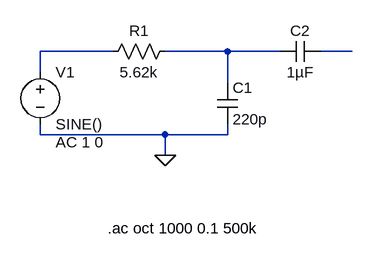
[diagram p0: schematic ADC_LineIn_filt.asc]
ADC_LineIn_filt.asc, the LTspice schematic file:
Version 4
SHEET 1 880 680
WIRE -16 32 -128 32
WIRE 160 32 64 32
WIRE 240 32 160 32
WIRE 352 32 304 32
WIRE -128 64 -128 32
WIRE 160 80 160 32
WIRE -128 160 -128 144
WIRE 64 160 -128 160
WIRE 160 160 160 144
WIRE 160 160 64 160
WIRE 64 192 64 160
FLAG 64 192 0
SYMBOL voltage -128 48 R0
WINDOW 123 24 124 Left 2
WINDOW 39 0 0 Left 0
SYMATTR InstName V1
SYMATTR Value SINE()
SYMATTR Value2 AC 1 0
SYMBOL cap 144 80 R0
SYMATTR InstName C1
SYMATTR Value 220p
SYMBOL cap 304 16 R90
WINDOW 0 0 32 VBottom 2
WINDOW 3 32 32 VTop 2
SYMATTR InstName C2
SYMATTR Value 1µF
SYMBOL res 80 16 R90
WINDOW 0 0 56 VBottom 2
WINDOW 3 32 56 VTop 2
SYMATTR InstName R1
SYMATTR Value 5.62k
TEXT -24 304 Left 2 !.ac oct 1000 0.1 500k

The netlist it stands for:
* ADC_LineIn_filt.asc
V1 N001 0 SINE() AC 1 0
C1 N002 0 220p
C2 N003 N002 1µF
R1 N002 N001 5.62k
.ac oct 1000 0.1 500k
.backanno
.end